# EasyEDA schematic soap-disp-smd-32-channel-min.json

## Sheets
1 Computer: TITLE: Sheet_1; REV: 1.0; Date: 2021-03-28; Sheet: 1/1; Drawn By: Suresh Kumar Gadi; Company: Your Company
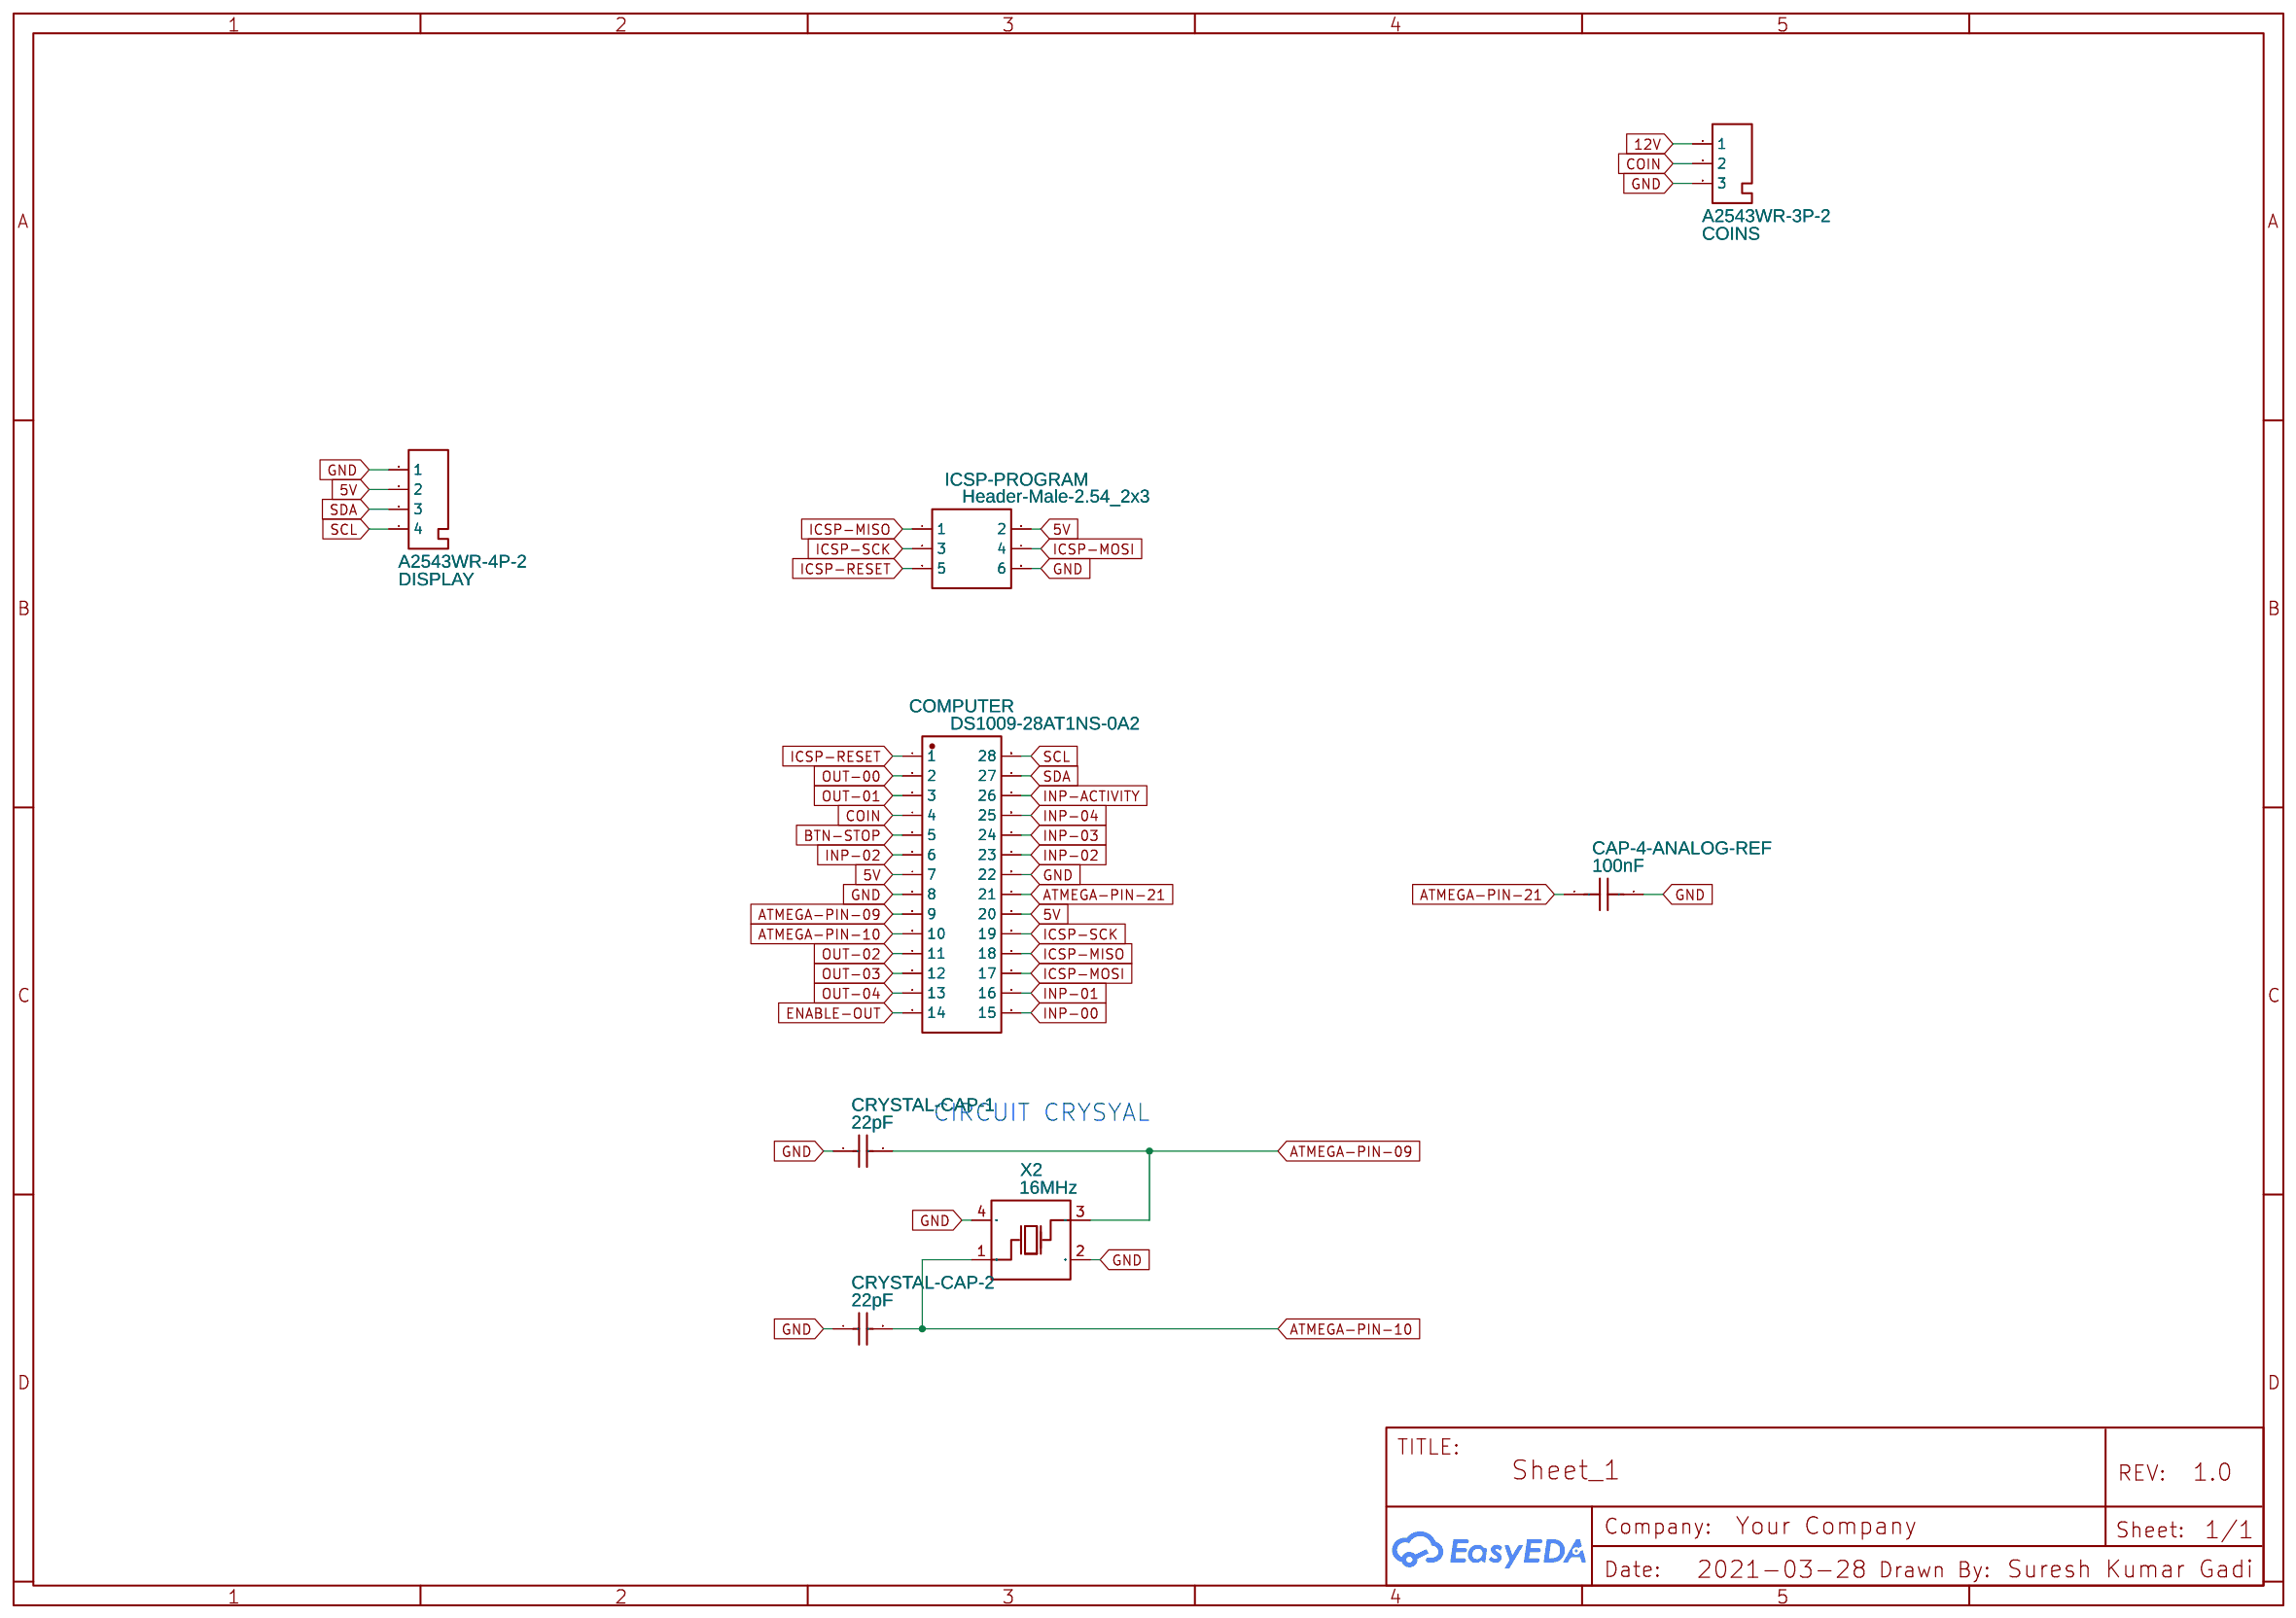
[diagram p0: Computer]
2 Relays: TITLE: Sheet_2
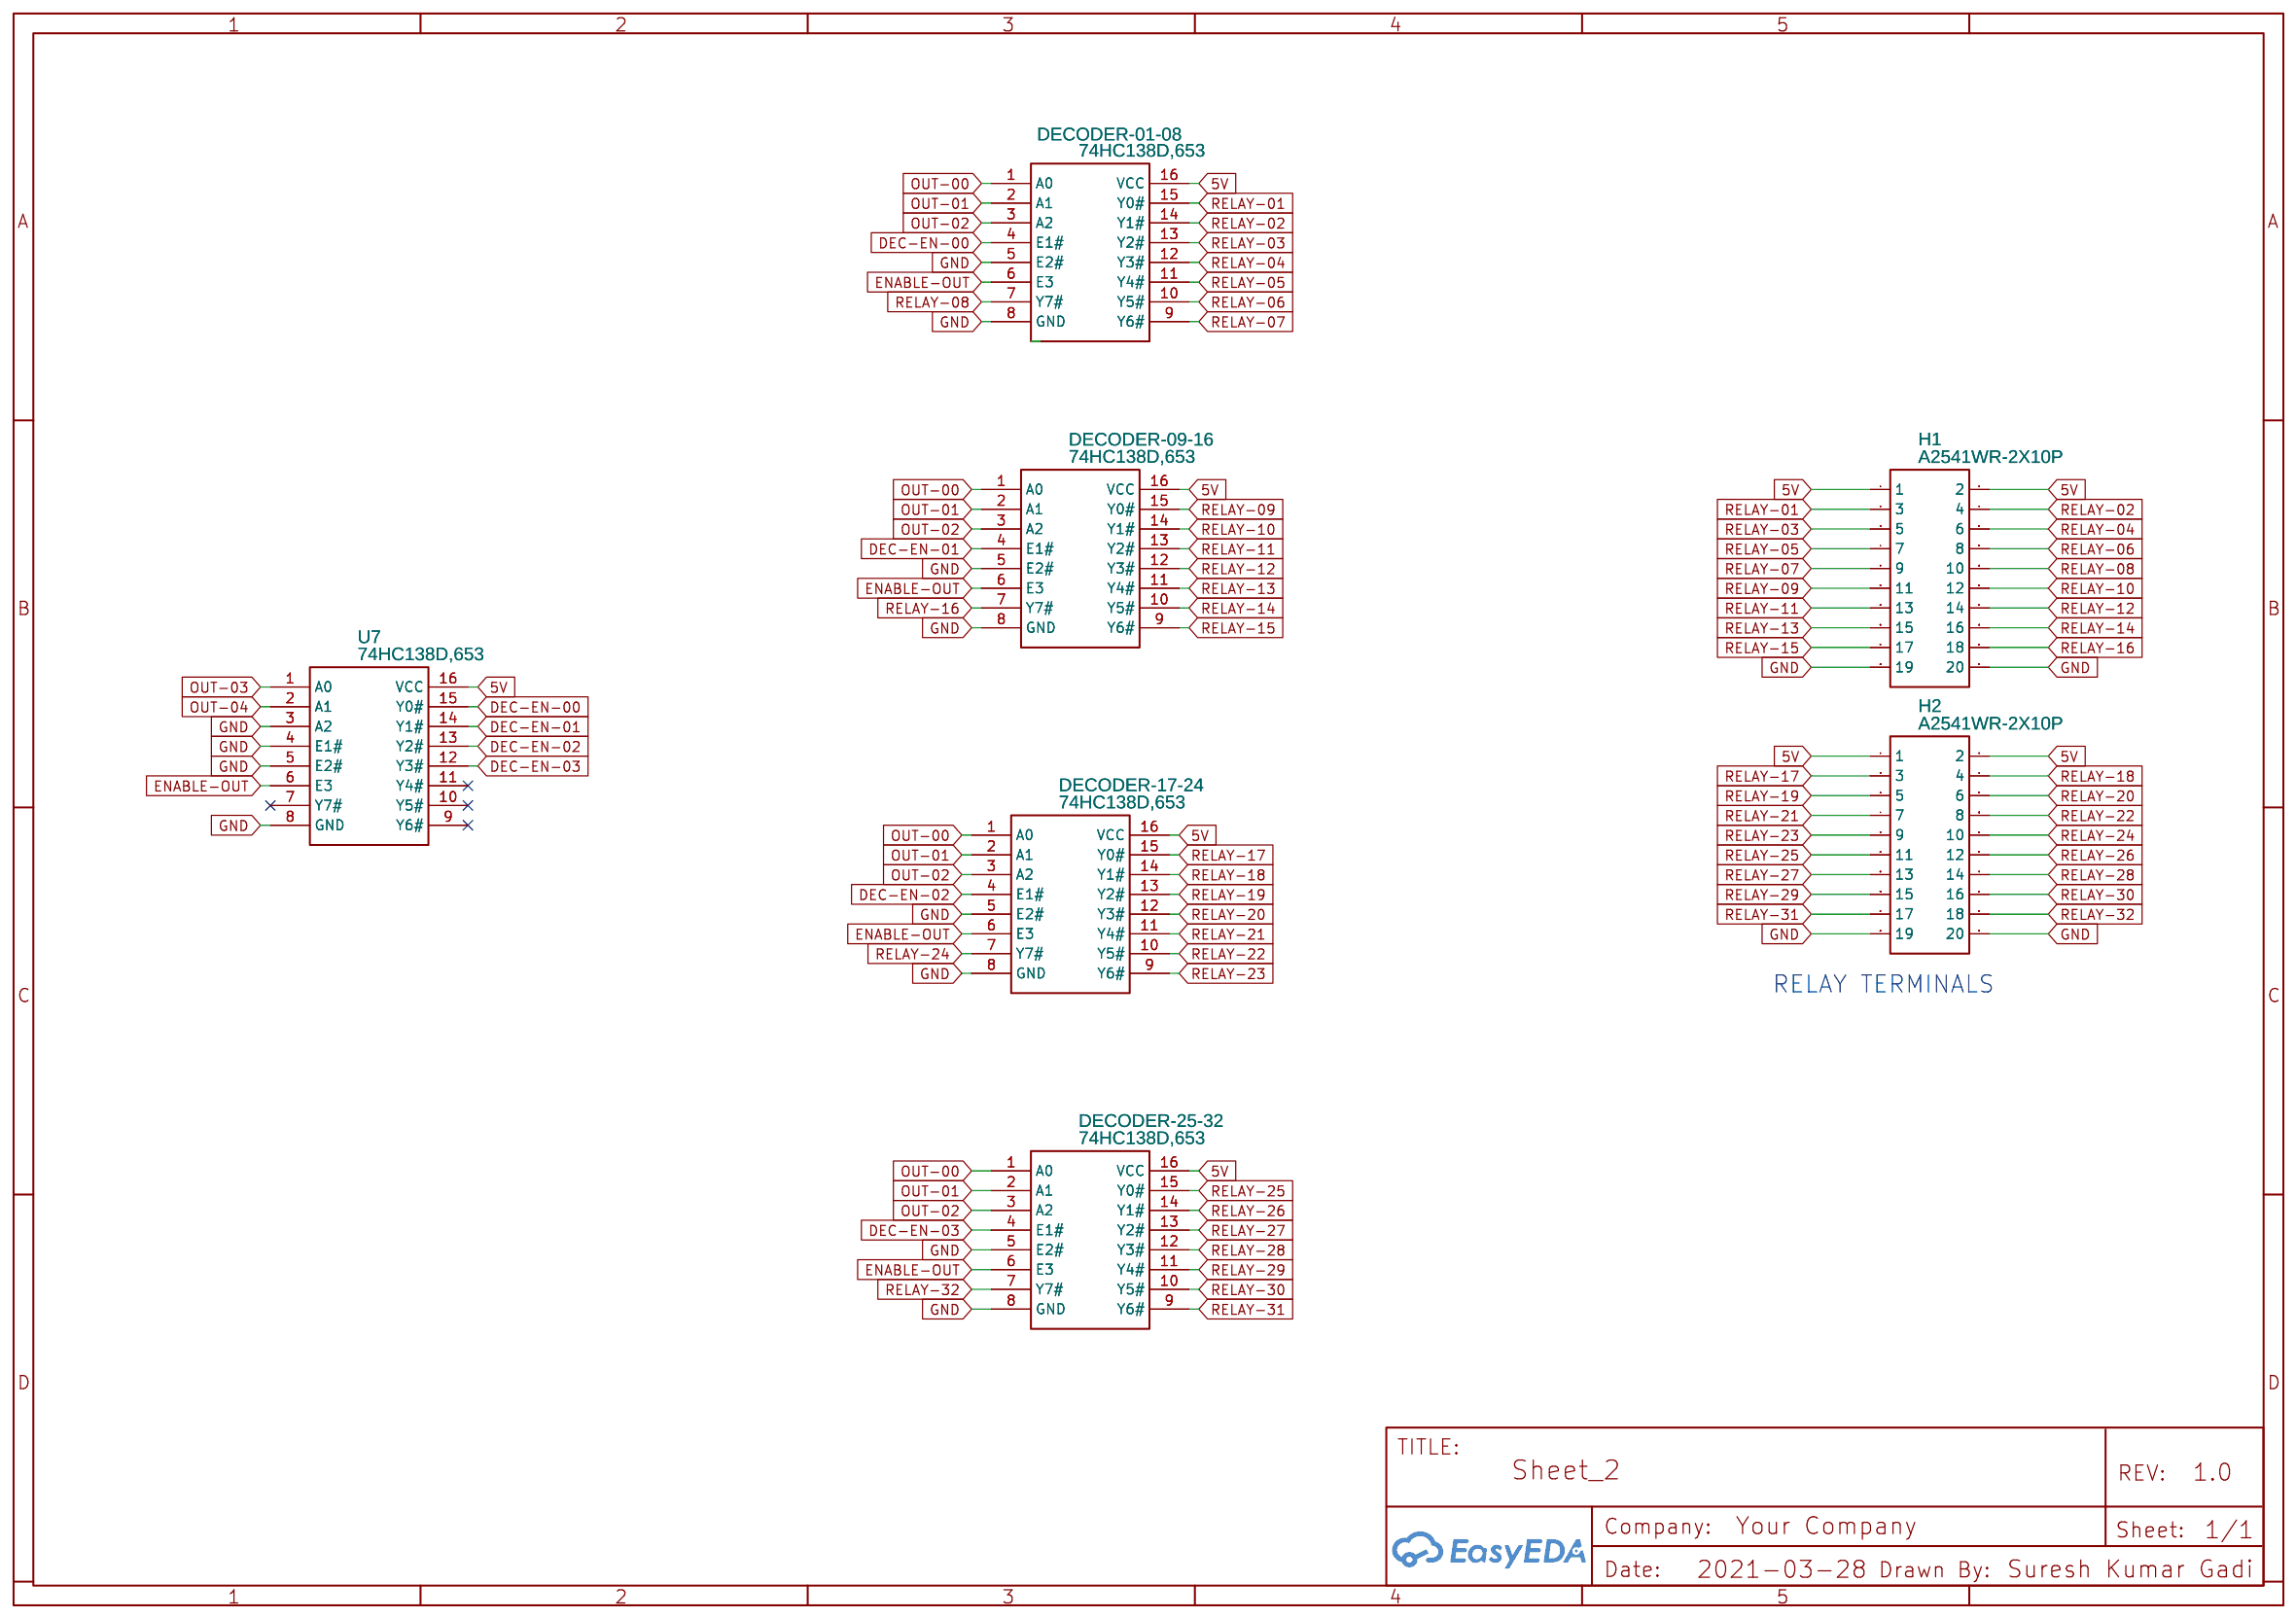
[diagram p1: Relays]
3 Buttons: TITLE: Sheet_2
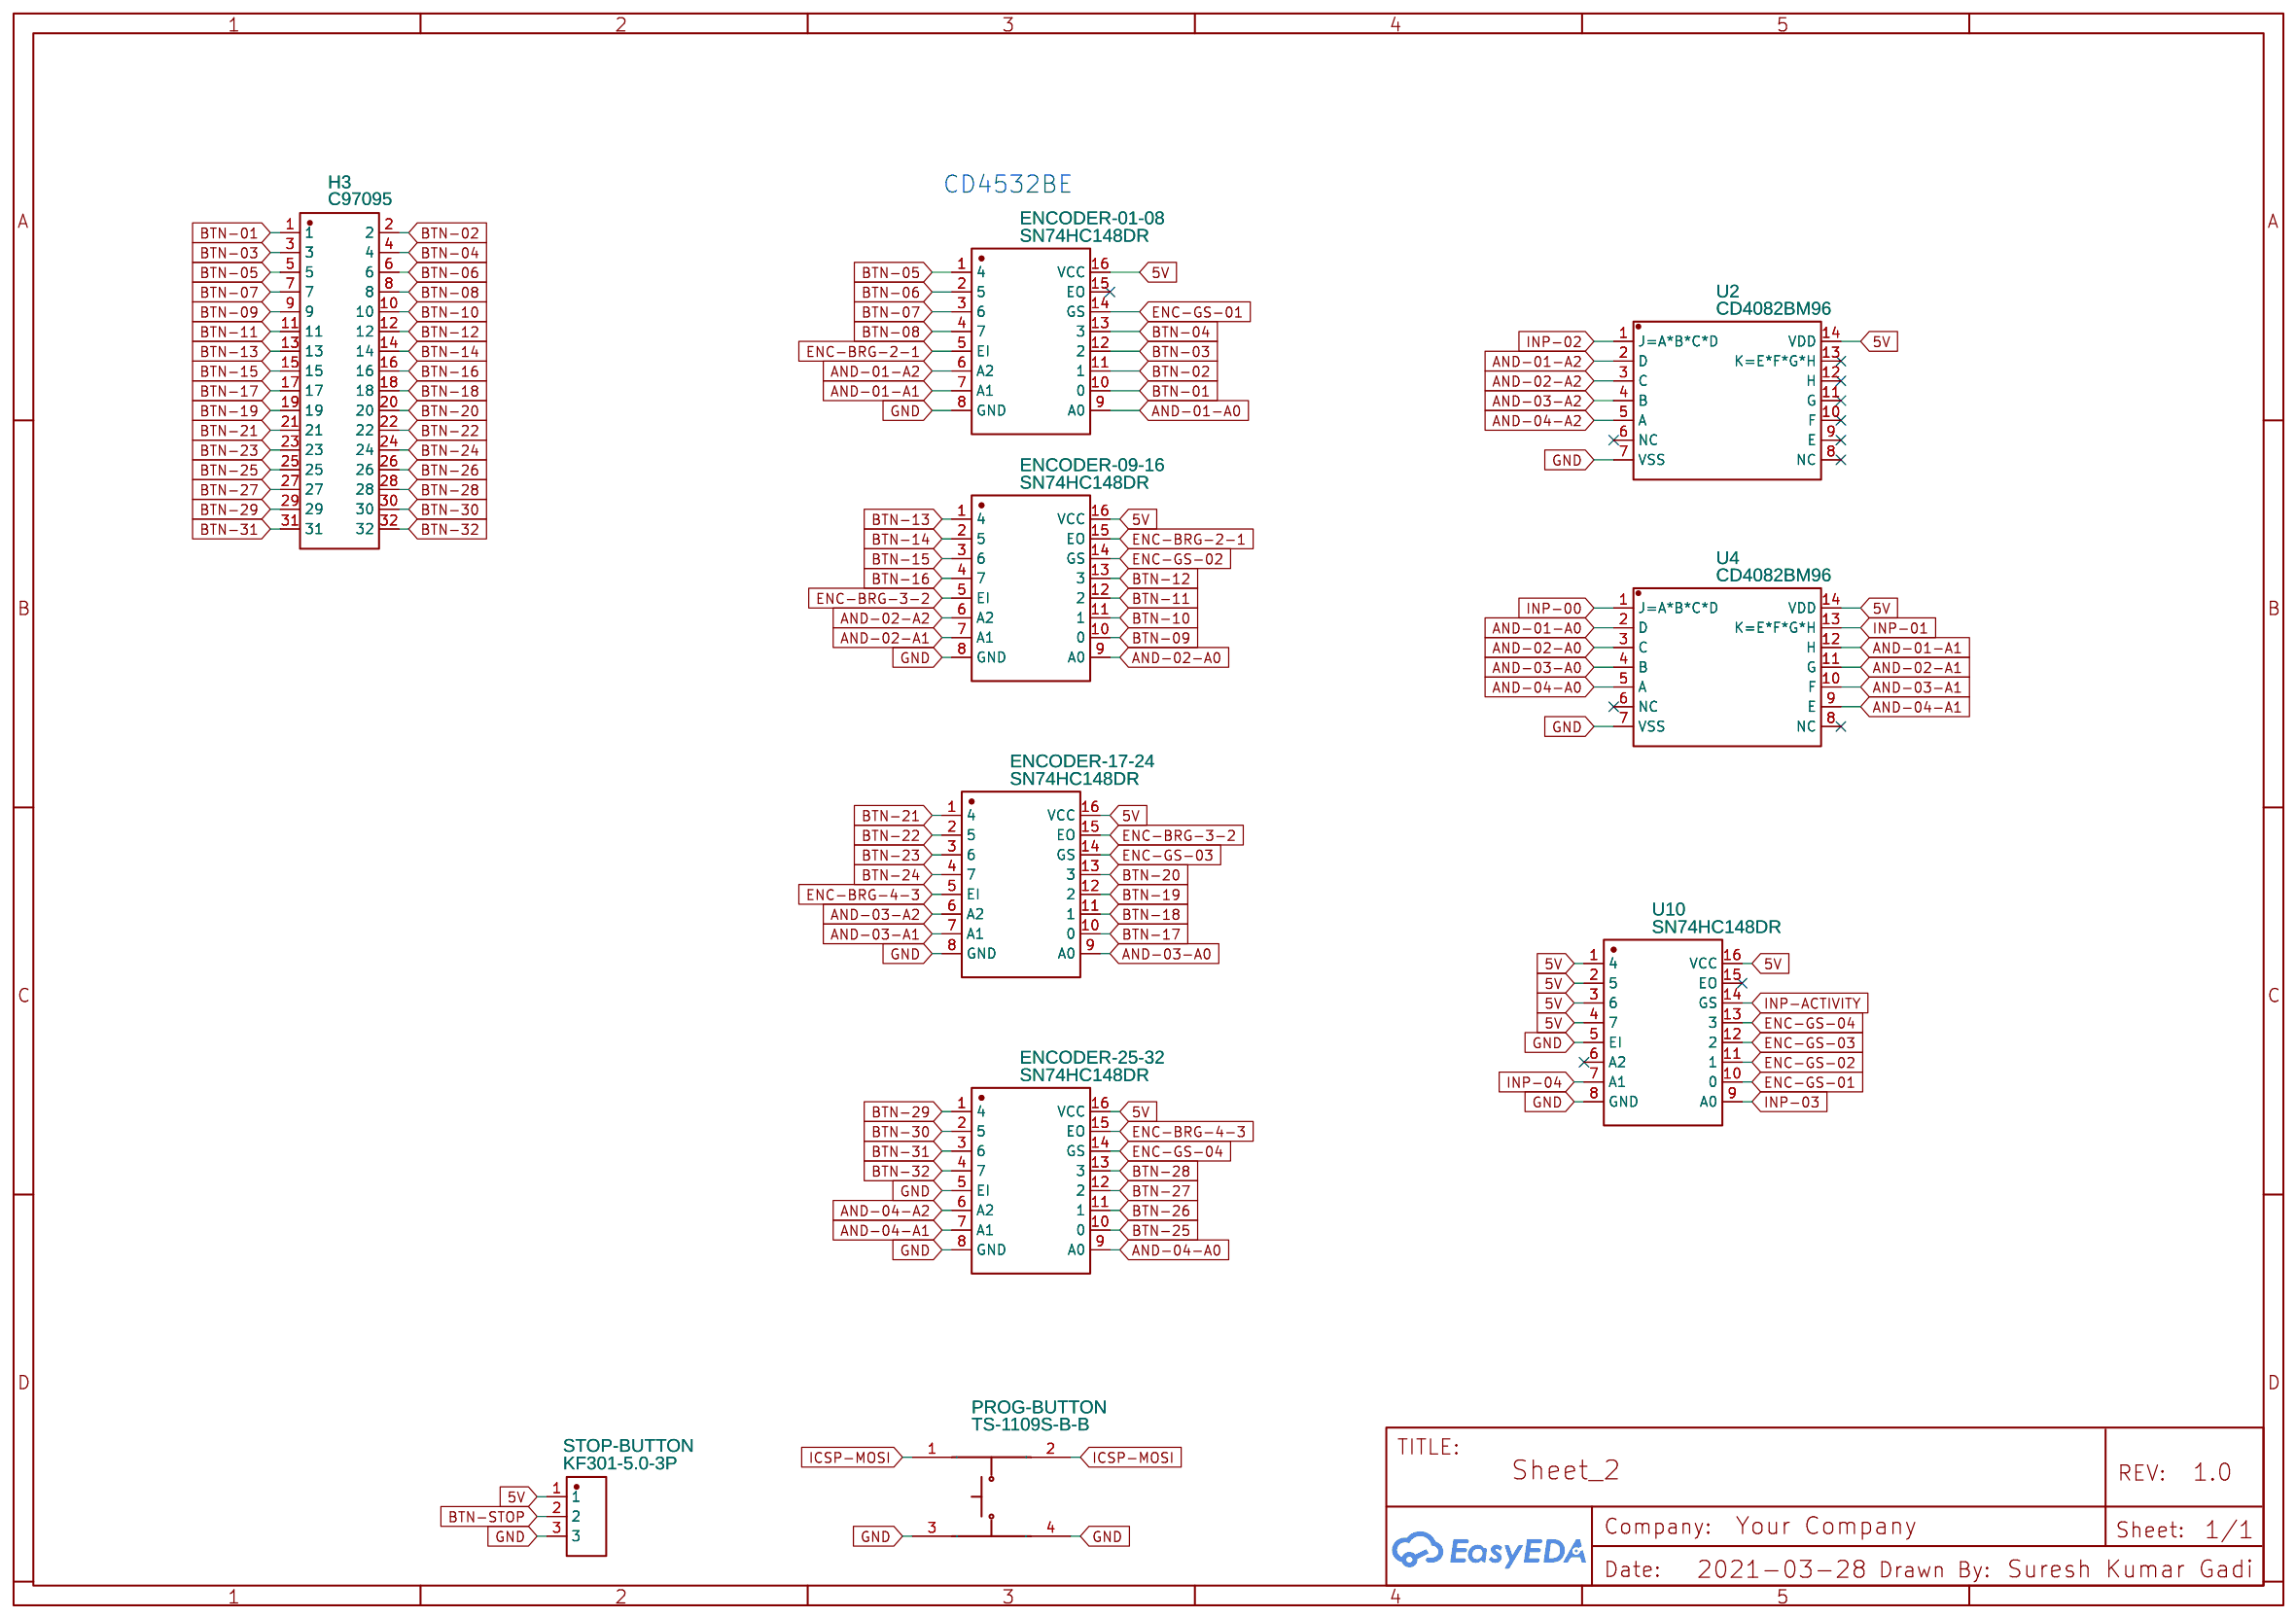
[diagram p2: Buttons]
4 Power: TITLE: Sheet_2
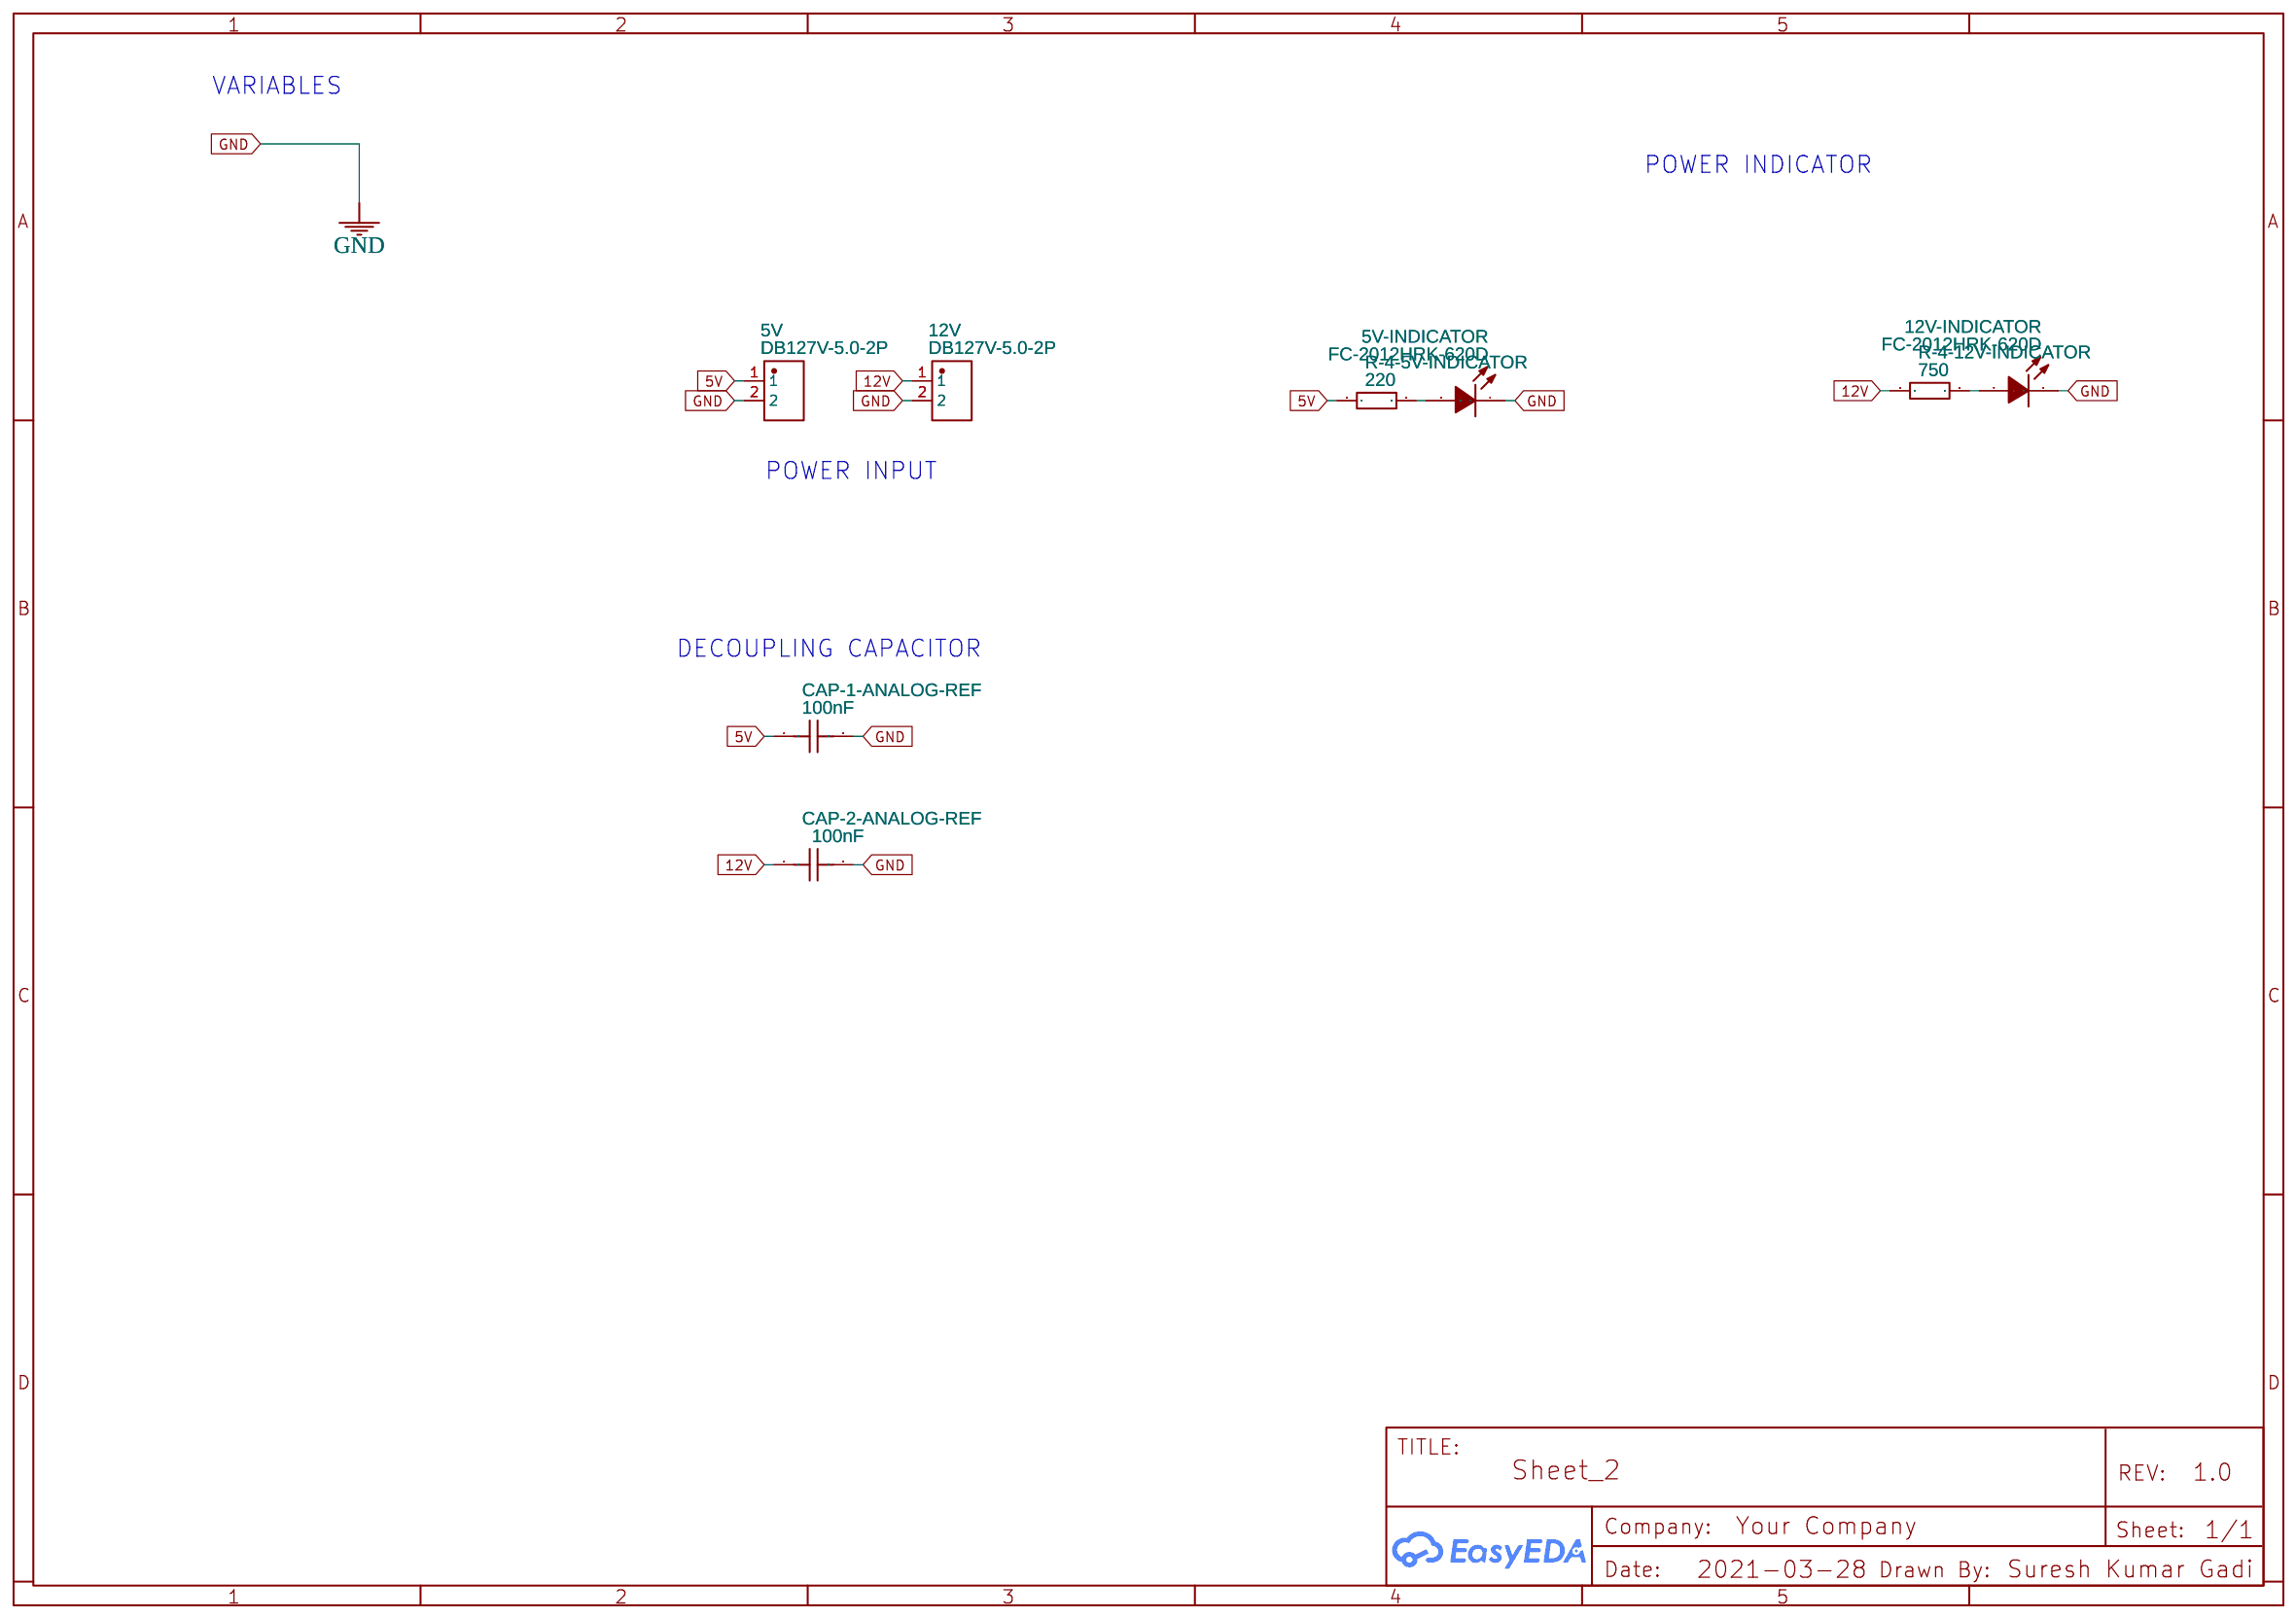
[diagram p3: Power]
5 Pull up-down: Date: 2021-03-29
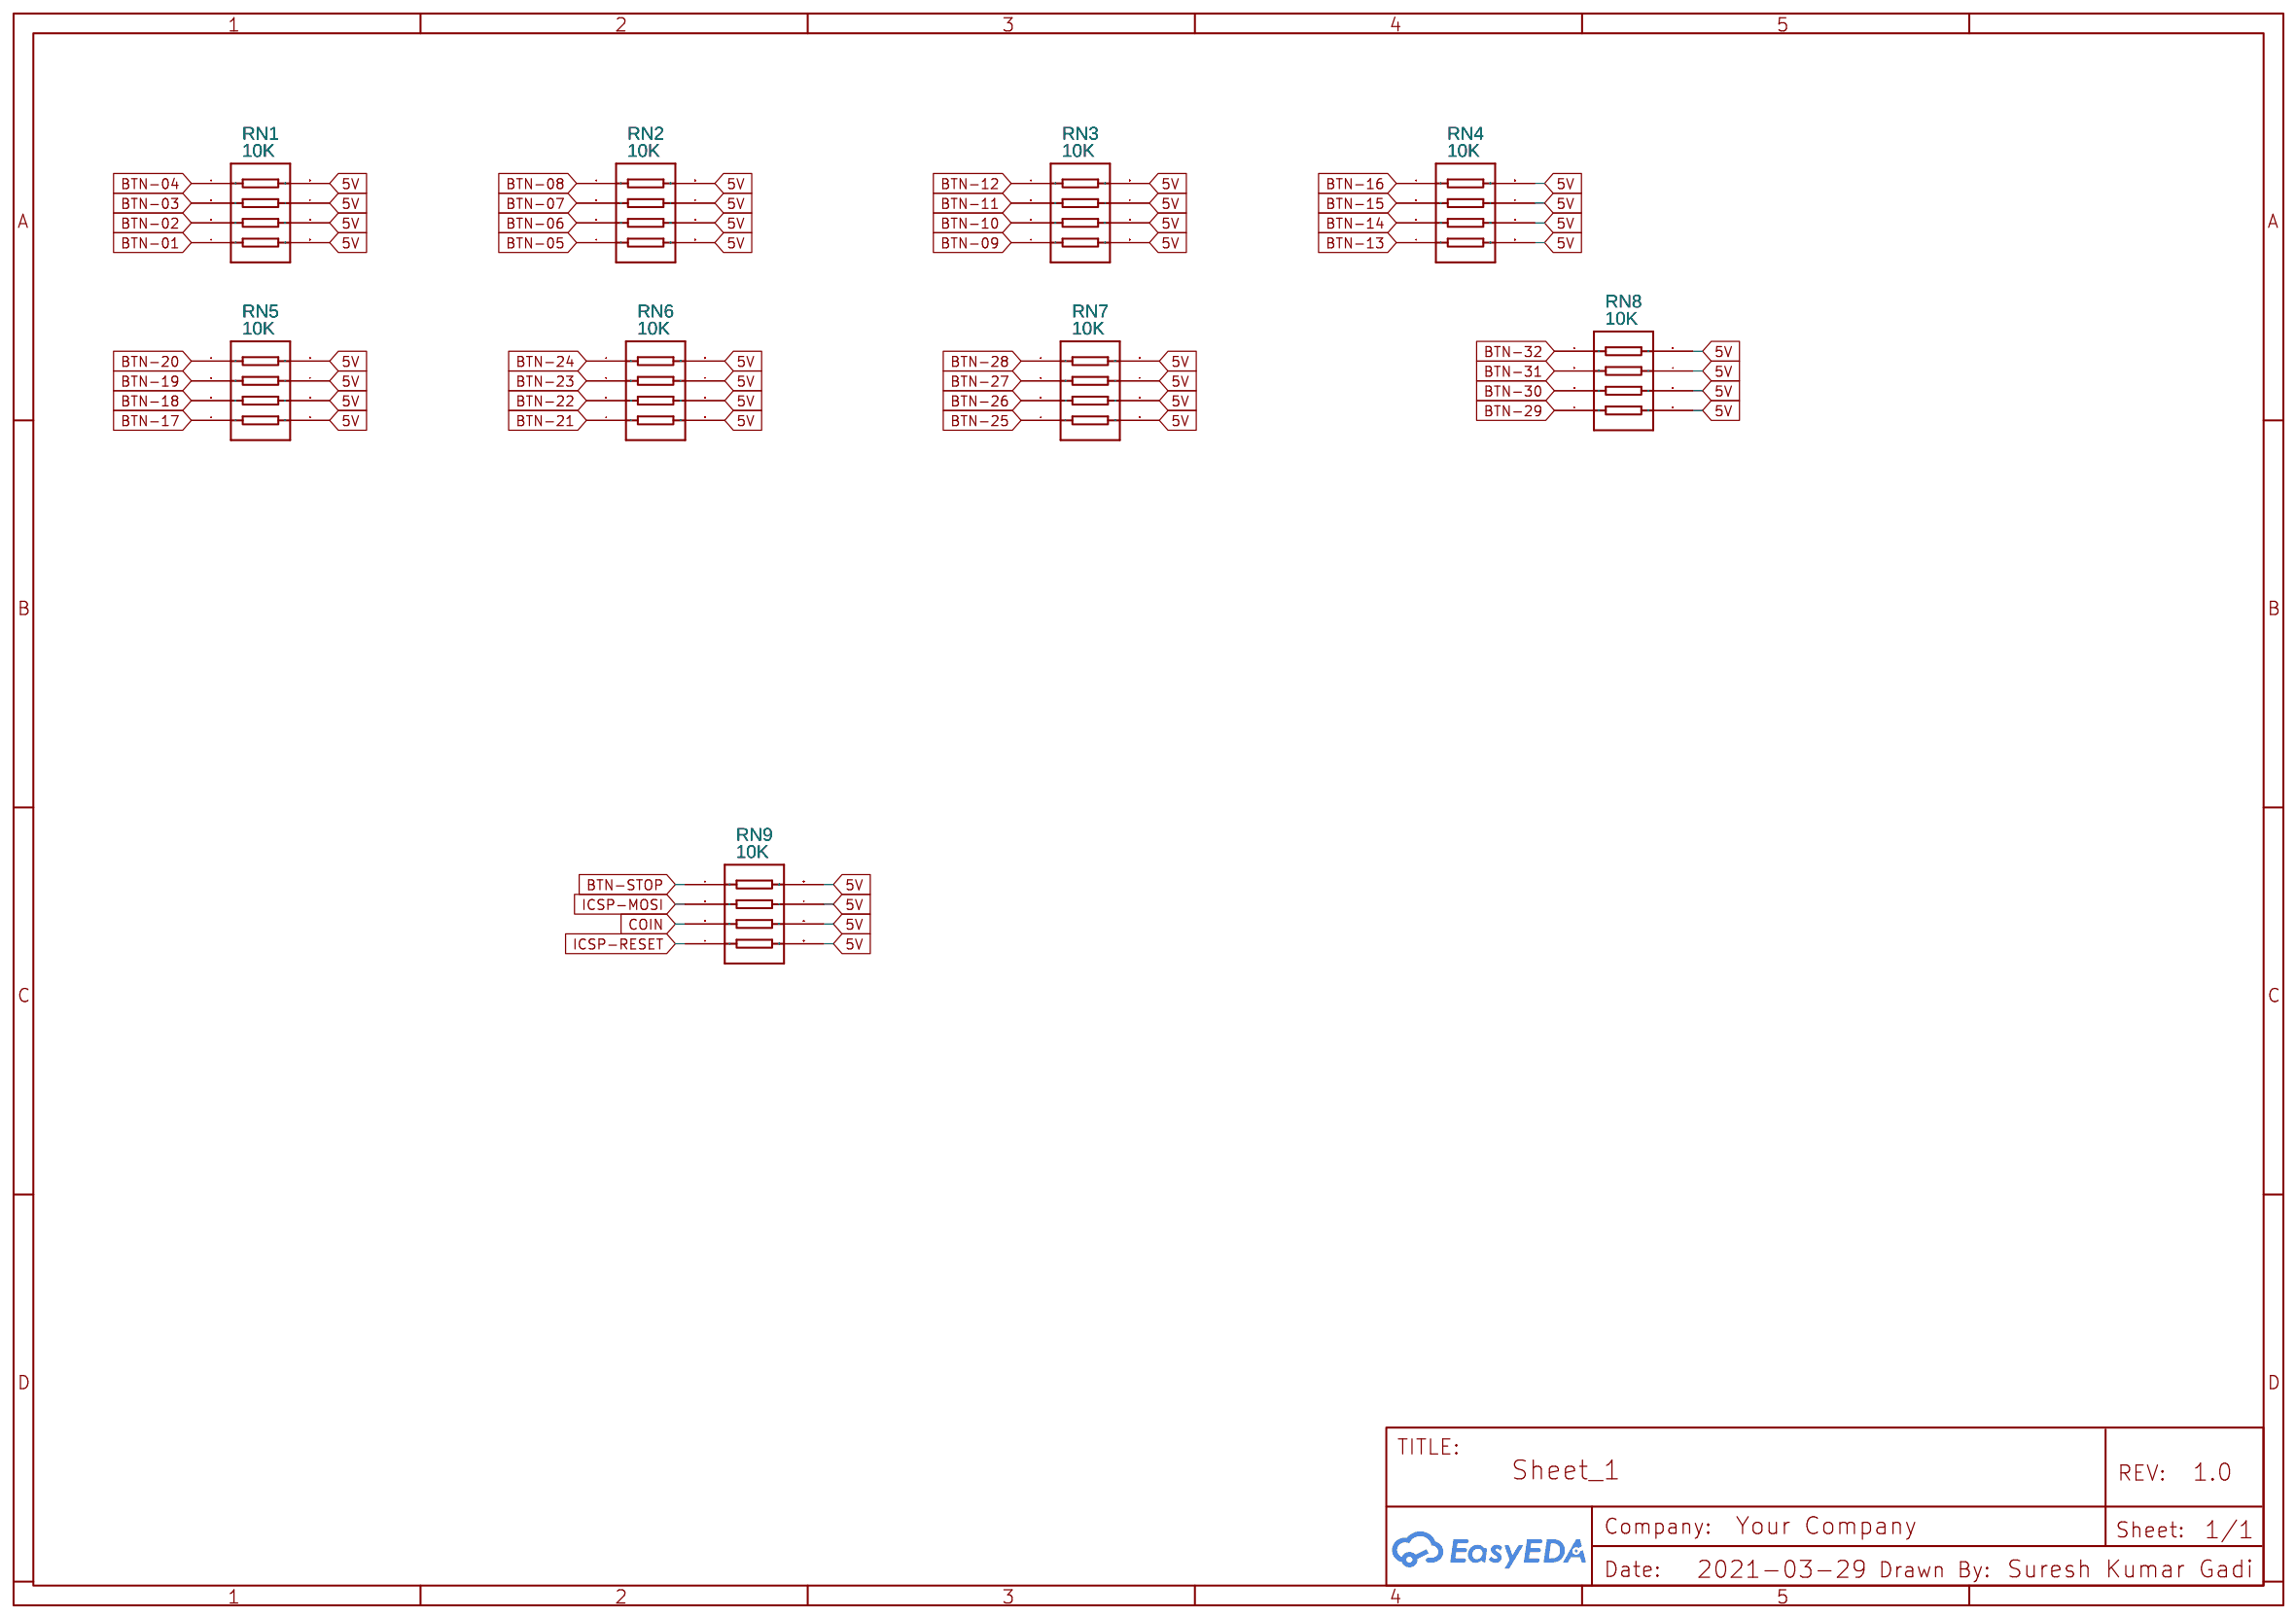
[diagram p4: Pull up-down]

## Parts
sheet Buttons
ENCODER-01-08  SN74HC148DR  [SOIC-16_L9.9-W3.9-P1.27-LS6.0-BL]
ENCODER-09-16  SN74HC148DR  [SOIC-16_L9.9-W3.9-P1.27-LS6.0-BL]
ENCODER-17-24  SN74HC148DR  [SOIC-16_L9.9-W3.9-P1.27-LS6.0-BL]
ENCODER-25-32  SN74HC148DR  [SOIC-16_L9.9-W3.9-P1.27-LS6.0-BL]
H3  C97095  [HDR-TH_32P-P2.54-H-R2-C16-S2.54]
PROG-BUTTON  TS-1109S-B-B  [SW-SMD_4P-L4.5-W4.5-P3.00-LS7.0]
STOP-BUTTON  KF301-5.0-3P  [CONN-TH_3P-P5.00_KF301-5.0-3P]
U2  CD4082BM96  [SOIC-14_L8.7-W3.9-P1.27-LS6.0-BL]
U4  CD4082BM96  [SOIC-14_L8.7-W3.9-P1.27-LS6.0-BL]
U10  SN74HC148DR  [SOIC-16_L9.9-W3.9-P1.27-LS6.0-BL]
sheet Computer
CAP-4-ANALOG-REF  100nF  [C0603]
COINS  A2543WR-3P-2  [CONN-TH_PHD2-3P-2.54]
COMPUTER  DS1009-28AT1NS-0A2  [DIP-28_L35.6-W10.2-P2.54-LS7.62-BL]
CRYSTAL-CAP-1  22pF  [C0805]
CRYSTAL-CAP-2  22pF  [C0805]
DISPLAY  A2543WR-4P-2  [CONN-TH_PHD2-4P-2.54]
ICSP-PROGRAM  Header-Male-2.54_2x3  [HDR-TH_6P-P2.54-V-R2-C3-S2.54]
X2  16MHz  [OSC-SMD_4P-L3.2-W2.5-BL]
sheet Power
5V  DB127V-5.0-2P  [CONN-TH_2P-P5.08_L8.5-W10.2]
5V-INDICATOR  FC-2012HRK-620D  [LED0805-RD]
12V  DB127V-5.0-2P  [CONN-TH_2P-P5.08_L8.5-W10.2]
12V-INDICATOR  FC-2012HRK-620D  [LED0805-RD]
CAP-1-ANALOG-REF  100nF  [C0603]
CAP-2-ANALOG-REF  100nF  [C0603]
R-4-5V-INDICATOR  220  [R0805]
R-4-12V-INDICATOR  750  [R1206]
sheet Pull up-down
RN1  10K  [RES-ARRAY-SMD_0603-8P-L3.2-W1.6-BL]
RN2  10K  [RES-ARRAY-SMD_0603-8P-L3.2-W1.6-BL]
RN3  10K  [RES-ARRAY-SMD_0603-8P-L3.2-W1.6-BL]
RN4  10K  [RES-ARRAY-SMD_0603-8P-L3.2-W1.6-BL]
RN5  10K  [RES-ARRAY-SMD_0603-8P-L3.2-W1.6-BL]
RN6  10K  [RES-ARRAY-SMD_0603-8P-L3.2-W1.6-BL]
RN7  10K  [RES-ARRAY-SMD_0603-8P-L3.2-W1.6-BL]
RN8  10K  [RES-ARRAY-SMD_0603-8P-L3.2-W1.6-BL]
RN9  10K  [RES-ARRAY-SMD_0603-8P-L3.2-W1.6-BL]
sheet Relays
DECODER-01-08  74HC138D,653  [SOIC-16_L9.9-W3.9-P1.27-LS6.0-BL]
DECODER-09-16  74HC138D,653  [SOIC-16_L9.9-W3.9-P1.27-LS6.0-BL]
DECODER-17-24  74HC138D,653  [SOIC-16_L9.9-W3.9-P1.27-LS6.0-BL]
DECODER-25-32  74HC138D,653  [SOIC-16_L9.9-W3.9-P1.27-LS6.0-BL]
H1  A2541WR-2X10P  [CONN-TH_A2541WR-2X10P]
H2  A2541WR-2X10P  [CONN-TH_A2541WR-2X10P]
U7  74HC138D,653  [SOIC-16_L9.9-W3.9-P1.27-LS6.0-BL]

## Library data of the parts
ENCODER-01-08 ENCODER-09-16 ENCODER-17-24 ENCODER-25-32 U10 = SN74HC148DR: Supplier: LCSC; Manufacturer: TI; Supplier Part: C6819; SMT Type: Extend; JLCPCB SMD: Yes; LCSC Assembly: Yes; Paste Type: expand
H3 = C97095: Supplier: LCSC; Manufacturer: Boom Precision Elec; Contributor: LCSC; LCSC Assembly: Yes; SMT Type: Extend; Paste Type: expand
PROG-BUTTON = TS-1109S-B-B: Supplier: LCSC; Supplier Part: C480315; Manufacturer: XKB Enterprise; Contributor: LCSC; SMT Type: Extend; JLCPCB SMD: Yes; Paste Type: recommend
STOP-BUTTON = KF301-5.0-3P: Supplier: LCSC; Supplier Part: C474882; Manufacturer: Cixi Kefa Elec; Contributor: LCSC; LCSC Assembly: Yes; SMT Type: Extend; Paste Type: expand
U2 U4 = CD4082BM96: Supplier: LCSC; Supplier Part: C193801; Manufacturer: Texas Instruments; Contributor: LCSC; SMT Type: Extend; JLCPCB SMD: Yes; LCSC Assembly: Yes; Paste Type: expand
CAP-1-ANALOG-REF CAP-2-ANALOG-REF CAP-4-ANALOG-REF = CC0603KRX7R9BB104: Supplier: LCSC; Manufacturer: YAGEO; Supplier Part: C14663; SMT Type: Basic; JLCPCB SMD: Yes; LCSC Assembly: Yes; Paste Type: base
COINS = A2543WR-3P-2: Supplier: LCSC; Supplier Part: C239370; Manufacturer: Changjiang Connectors; Contributor: LCSC; link: https://item.szlcsc.com/238474.html?ref=editor&logined=true; LCSC Assembly: Yes; SMT Type: Extend; Paste Type: expand
COMPUTER = DS1009-28AT1NS-0A2: Supplier: LCSC; Manufacturer: CONNFLY; image: //image.lceda.cn/szlcsc/C72125.jpg; Contributor: LCSC; Supplier Part: C72125; LCSC Assembly: Yes; SMT Type: Extend; Paste Type: expand
CRYSTAL-CAP-1 CRYSTAL-CAP-2 = CL21C220JBANNNC: Supplier: LCSC; Manufacturer: SAMSUNG; Supplier Part: C1804; SMT Type: Basic; JLCPCB SMD: Yes; LCSC Assembly: Yes; Paste Type: base
DISPLAY = A2543WR-4P-2: Supplier: LCSC; Supplier Part: C239371; Manufacturer: Changjiang Connectors; Contributor: LCSC; link: https://item.szlcsc.com/238475.html?ref=editor&logined=true; LCSC Assembly: Yes; SMT Type: Extend; Paste Type: expand
ICSP-PROGRAM = Header-Male-2.54_2x3: Supplier: LCSC; Manufacturer: BOOMELE; Supplier Part: C65114; LCSC Assembly: Yes; SMT Type: Extend; Paste Type: expand
X2 = X322516MLB4SI: Supplier: LCSC; Manufacturer: YXC; Supplier Part: C13738; SMT Type: Basic; JLCPCB SMD: Yes; LCSC Assembly: Yes; Paste Type: base
5V 12V = DB127V-5.0-2P: Supplier: LCSC; Supplier Part: C395885; Manufacturer: DIBO; Contributor: LCSC; LCSC Assembly: Yes; SMT Type: Extend; Paste Type: expand
5V-INDICATOR 12V-INDICATOR = FC-2012HRK-620D: Supplier: LCSC; Manufacturer: NATIONSTAR; image: //image.lceda.cn/szlcsc/C84256.jpg; Supplier Part: C84256; SMT Type: Basic; JLCPCB SMD: Yes; LCSC Assembly: Yes; Paste Type: base
R-4-5V-INDICATOR = 0805W8F2200T5E: Supplier: LCSC; Manufacturer: UniOhm; Supplier Part: C17557; SMT Type: Basic; JLCPCB SMD: Yes; LCSC Assembly: Yes; Paste Type: base
R-4-12V-INDICATOR = 1206W4F7500T5E: Supplier: LCSC; Manufacturer: UniOhm; Supplier Part: C17985; SMT Type: Basic; JLCPCB SMD: Yes; LCSC Assembly: Yes; Paste Type: base
RN1-RN9 = 4D03WGJ0103T5E: Supplier: LCSC; Manufacturer: UniOhm; Supplier Part: C29718; SMT Type: Basic; JLCPCB SMD: Yes; LCSC Assembly: Yes; Paste Type: base
DECODER-01-08 DECODER-09-16 DECODER-17-24 DECODER-25-32 U7 = 74HC138D,653: Supplier: LCSC; Manufacturer: Nexperia; image: //image.lceda.cn/szlcsc/C5602.jpg; Supplier Part: C5602; SMT Type: Basic; JLCPCB SMD: Yes; LCSC Assembly: Yes; Paste Type: base
H1 H2 = A2541WR-2X10P: Supplier: LCSC; Supplier Part: C239341; Manufacturer: Changjiang Connectors; Manufacturer Part: A2541WR-2x10P; Contributor: LCSC; link: https://item.szlcsc.com/238445.html?ref=editor&logined=true; LCSC Assembly: Yes; SMT Type: Extend; Paste Type: expand

## Nets
5V: 5V.1 CAP-1-ANALOG-REF.1 COMPUTER.7 COMPUTER.20 DECODER-01-08.16(VCC) DECODER-09-16.16(VCC) DECODER-17-24.16(VCC) DECODER-25-32.16(VCC) DISPLAY.2 ENCODER-01-08.16(VCC) ENCODER-09-16.16(VCC) ENCODER-17-24.16(VCC) ENCODER-25-32.16(VCC) H1.1 H1.2 H2.1 H2.2 ICSP-PROGRAM.2 R-4-5V-INDICATOR.1 RN1.5 RN1.6 RN1.7 RN1.8 RN2.5 RN2.6 RN2.7 RN2.8 RN3.5 RN3.6 RN3.7 RN3.8 RN4.5 RN4.6 RN4.7 RN4.8 RN5.5 RN5.6 RN5.7 RN5.8 RN6.5 RN6.6 RN6.7 RN6.8 RN7.5 RN7.6 RN7.7 RN7.8 RN8.5 RN8.6 RN8.7 RN8.8 RN9.5 RN9.6 RN9.7 RN9.8 STOP-BUTTON.1 U2.14(VDD) U4.14(VDD) U7.16(VCC) U10.1(4) U10.2(5) U10.3(6) U10.4(7) U10.16(VCC)
12V: 12V.1 CAP-2-ANALOG-REF.1 COINS.1 R-4-12V-INDICATOR.1
GND: 5V.2 5V-INDICATOR.1(-) 12V.2 12V-INDICATOR.1(-) CAP-1-ANALOG-REF.2 CAP-2-ANALOG-REF.2 CAP-4-ANALOG-REF.2 COINS.3 COMPUTER.8 COMPUTER.22 CRYSTAL-CAP-1.1 CRYSTAL-CAP-2.1 DECODER-01-08.5(E2#) DECODER-01-08.8(GND) DECODER-09-16.5(E2#) DECODER-09-16.8(GND) DECODER-17-24.5(E2#) DECODER-17-24.8(GND) DECODER-25-32.5(E2#) DECODER-25-32.8(GND) DISPLAY.1 ENCODER-01-08.8(GND) ENCODER-09-16.8(GND) ENCODER-17-24.8(GND) ENCODER-25-32.5(EI) ENCODER-25-32.8(GND) H1.19 H1.20 H2.19 H2.20 ICSP-PROGRAM.6 PROG-BUTTON.3 PROG-BUTTON.4 STOP-BUTTON.3 U2.7(VSS) U4.7(VSS) U7.3(A2) U7.4(E1#) U7.5(E2#) U7.8(GND) U10.5(EI) U10.8(GND) X2.2(GND) X2.4(GND)
AND-01-A0: ENCODER-01-08.9(A0) U4.2(D)
AND-01-A1: ENCODER-01-08.7(A1) U4.12(H)
AND-01-A2: ENCODER-01-08.6(A2) U2.2(D)
AND-02-A0: ENCODER-09-16.9(A0) U4.3(C)
AND-02-A1: ENCODER-09-16.7(A1) U4.11(G)
AND-02-A2: ENCODER-09-16.6(A2) U2.3(C)
AND-03-A0: ENCODER-17-24.9(A0) U4.4(B)
AND-03-A1: ENCODER-17-24.7(A1) U4.10(F)
AND-03-A2: ENCODER-17-24.6(A2) U2.4(B)
AND-04-A0: ENCODER-25-32.9(A0) U4.5(A)
AND-04-A1: ENCODER-25-32.7(A1) U4.9(E)
AND-04-A2: ENCODER-25-32.6(A2) U2.5(A)
ATMEGA-PIN-09: COMPUTER.9 CRYSTAL-CAP-1.2 X2.3(OSC2)
ATMEGA-PIN-10: COMPUTER.10 CRYSTAL-CAP-2.2 X2.1(OSC1)
ATMEGA-PIN-21: CAP-4-ANALOG-REF.1 COMPUTER.21
BTN-01: ENCODER-01-08.10(0) H3.1 RN1.4
BTN-02: ENCODER-01-08.11(1) H3.2 RN1.3
BTN-03: ENCODER-01-08.12(2) H3.3 RN1.2
BTN-04: ENCODER-01-08.13(3) H3.4 RN1.1
BTN-05: ENCODER-01-08.1(4) H3.5 RN2.4
BTN-06: ENCODER-01-08.2(5) H3.6 RN2.3
BTN-07: ENCODER-01-08.3(6) H3.7 RN2.2
BTN-08: ENCODER-01-08.4(7) H3.8 RN2.1
BTN-09: ENCODER-09-16.10(0) H3.9 RN3.4
BTN-10: ENCODER-09-16.11(1) H3.10 RN3.3
BTN-11: ENCODER-09-16.12(2) H3.11 RN3.2
BTN-12: ENCODER-09-16.13(3) H3.12 RN3.1
BTN-13: ENCODER-09-16.1(4) H3.13 RN4.4
BTN-14: ENCODER-09-16.2(5) H3.14 RN4.3
BTN-15: ENCODER-09-16.3(6) H3.15 RN4.2
BTN-16: ENCODER-09-16.4(7) H3.16 RN4.1
BTN-17: ENCODER-17-24.10(0) H3.17 RN5.4
BTN-18: ENCODER-17-24.11(1) H3.18 RN5.3
BTN-19: ENCODER-17-24.12(2) H3.19 RN5.2
BTN-20: ENCODER-17-24.13(3) H3.20 RN5.1
BTN-21: ENCODER-17-24.1(4) H3.21 RN6.4
BTN-22: ENCODER-17-24.2(5) H3.22 RN6.3
BTN-23: ENCODER-17-24.3(6) H3.23 RN6.2
BTN-24: ENCODER-17-24.4(7) H3.24 RN6.1
BTN-25: ENCODER-25-32.10(0) H3.25 RN7.4
BTN-26: ENCODER-25-32.11(1) H3.26 RN7.3
BTN-27: ENCODER-25-32.12(2) H3.27 RN7.2
BTN-28: ENCODER-25-32.13(3) H3.28 RN7.1
BTN-29: ENCODER-25-32.1(4) H3.29 RN8.4
BTN-30: ENCODER-25-32.2(5) H3.30 RN8.3
BTN-31: ENCODER-25-32.3(6) H3.31 RN8.2
BTN-32: ENCODER-25-32.4(7) H3.32 RN8.1
BTN-STOP: COMPUTER.5 RN9.1 STOP-BUTTON.2
COIN: COINS.2 COMPUTER.4 RN9.3
DEC-EN-00: DECODER-01-08.4(E1#) U7.15(Y0#)
DEC-EN-01: DECODER-09-16.4(E1#) U7.14(Y1#)
DEC-EN-02: DECODER-17-24.4(E1#) U7.13(Y2#)
DEC-EN-03: DECODER-25-32.4(E1#) U7.12(Y3#)
ENABLE-OUT: COMPUTER.14 DECODER-01-08.6(E3) DECODER-09-16.6(E3) DECODER-17-24.6(E3) DECODER-25-32.6(E3) U7.6(E3)
ENC-BRG-2-1: ENCODER-01-08.5(EI) ENCODER-09-16.15(EO)
ENC-BRG-3-2: ENCODER-09-16.5(EI) ENCODER-17-24.15(EO)
ENC-BRG-4-3: ENCODER-17-24.5(EI) ENCODER-25-32.15(EO)
ENC-GS-01: ENCODER-01-08.14(GS) U10.10(0)
ENC-GS-02: ENCODER-09-16.14(GS) U10.11(1)
ENC-GS-03: ENCODER-17-24.14(GS) U10.12(2)
ENC-GS-04: ENCODER-25-32.14(GS) U10.13(3)
ICSP-MISO: COMPUTER.18 ICSP-PROGRAM.1
ICSP-MOSI: COMPUTER.17 ICSP-PROGRAM.4 PROG-BUTTON.1 PROG-BUTTON.2 RN9.2
ICSP-RESET: COMPUTER.1 ICSP-PROGRAM.5 RN9.4
ICSP-SCK: COMPUTER.19 ICSP-PROGRAM.3
INP-00: COMPUTER.15 U4.1(J=A*B*C*D)
INP-01: COMPUTER.16 U4.13(K=E*F*G*H)
INP-02: COMPUTER.6 COMPUTER.23 U2.1(J=A*B*C*D)
INP-03: COMPUTER.24 U10.9(A0)
INP-04: COMPUTER.25 U10.7(A1)
INP-ACTIVITY: COMPUTER.26 U10.14(GS)
OUT-00: COMPUTER.2 DECODER-01-08.1(A0) DECODER-09-16.1(A0) DECODER-17-24.1(A0) DECODER-25-32.1(A0)
OUT-01: COMPUTER.3 DECODER-01-08.2(A1) DECODER-09-16.2(A1) DECODER-17-24.2(A1) DECODER-25-32.2(A1)
OUT-02: COMPUTER.11 DECODER-01-08.3(A2) DECODER-09-16.3(A2) DECODER-17-24.3(A2) DECODER-25-32.3(A2)
OUT-03: COMPUTER.12 U7.1(A0)
OUT-04: COMPUTER.13 U7.2(A1)
RELAY-01: DECODER-01-08.15(Y0#) H1.3
RELAY-02: DECODER-01-08.14(Y1#) H1.4
RELAY-03: DECODER-01-08.13(Y2#) H1.5
RELAY-04: DECODER-01-08.12(Y3#) H1.6
RELAY-05: DECODER-01-08.11(Y4#) H1.7
RELAY-06: DECODER-01-08.10(Y5#) H1.8
RELAY-07: DECODER-01-08.9(Y6#) H1.9
RELAY-08: DECODER-01-08.7(Y7#) H1.10
RELAY-09: DECODER-09-16.15(Y0#) H1.11
RELAY-10: DECODER-09-16.14(Y1#) H1.12
RELAY-11: DECODER-09-16.13(Y2#) H1.13
RELAY-12: DECODER-09-16.12(Y3#) H1.14
RELAY-13: DECODER-09-16.11(Y4#) H1.15
RELAY-14: DECODER-09-16.10(Y5#) H1.16
RELAY-15: DECODER-09-16.9(Y6#) H1.17
RELAY-16: DECODER-09-16.7(Y7#) H1.18
RELAY-17: DECODER-17-24.15(Y0#) H2.3
RELAY-18: DECODER-17-24.14(Y1#) H2.4
RELAY-19: DECODER-17-24.13(Y2#) H2.5
RELAY-20: DECODER-17-24.12(Y3#) H2.6
RELAY-21: DECODER-17-24.11(Y4#) H2.7
RELAY-22: DECODER-17-24.10(Y5#) H2.8
RELAY-23: DECODER-17-24.9(Y6#) H2.9
RELAY-24: DECODER-17-24.7(Y7#) H2.10
RELAY-25: DECODER-25-32.15(Y0#) H2.11
RELAY-26: DECODER-25-32.14(Y1#) H2.12
RELAY-27: DECODER-25-32.13(Y2#) H2.13
RELAY-28: DECODER-25-32.12(Y3#) H2.14
RELAY-29: DECODER-25-32.11(Y4#) H2.15
RELAY-30: DECODER-25-32.10(Y5#) H2.16
RELAY-31: DECODER-25-32.9(Y6#) H2.17
RELAY-32: DECODER-25-32.7(Y7#) H2.18
SCL: COMPUTER.28 DISPLAY.4
SDA: COMPUTER.27 DISPLAY.3
Net-(5V-INDICATOR-2): 5V-INDICATOR.2(+) R-4-5V-INDICATOR.2
Net-(12V-INDICATOR-2): 12V-INDICATOR.2(+) R-4-12V-INDICATOR.2

Not connected (* = marked no-connect by the designer): ENCODER-01-08 15(EO)*; U2 6(NC)* 8(NC)* 9(E)* 10(F)* 11(G)* 12(H)* 13(K=E*F*G*H)*; U4 6(NC)* 8(NC)*; U7 7(Y7#)* 9(Y6#)* 10(Y5#)* 11(Y4#)*; U10 6(A2)* 15(EO)*

## Notes on the sheets
sheet 1
- CIRCUIT CRYSYAL
sheet 2
- RELAY TERMINALS
sheet 3
- CD4532BE
sheet 4
- VARIABLES
- POWER INDICATOR
- POWER INPUT
- DECOUPLING CAPACITOR
